# Altium project SZG-STD-FT60X-USBC.PrjPcb
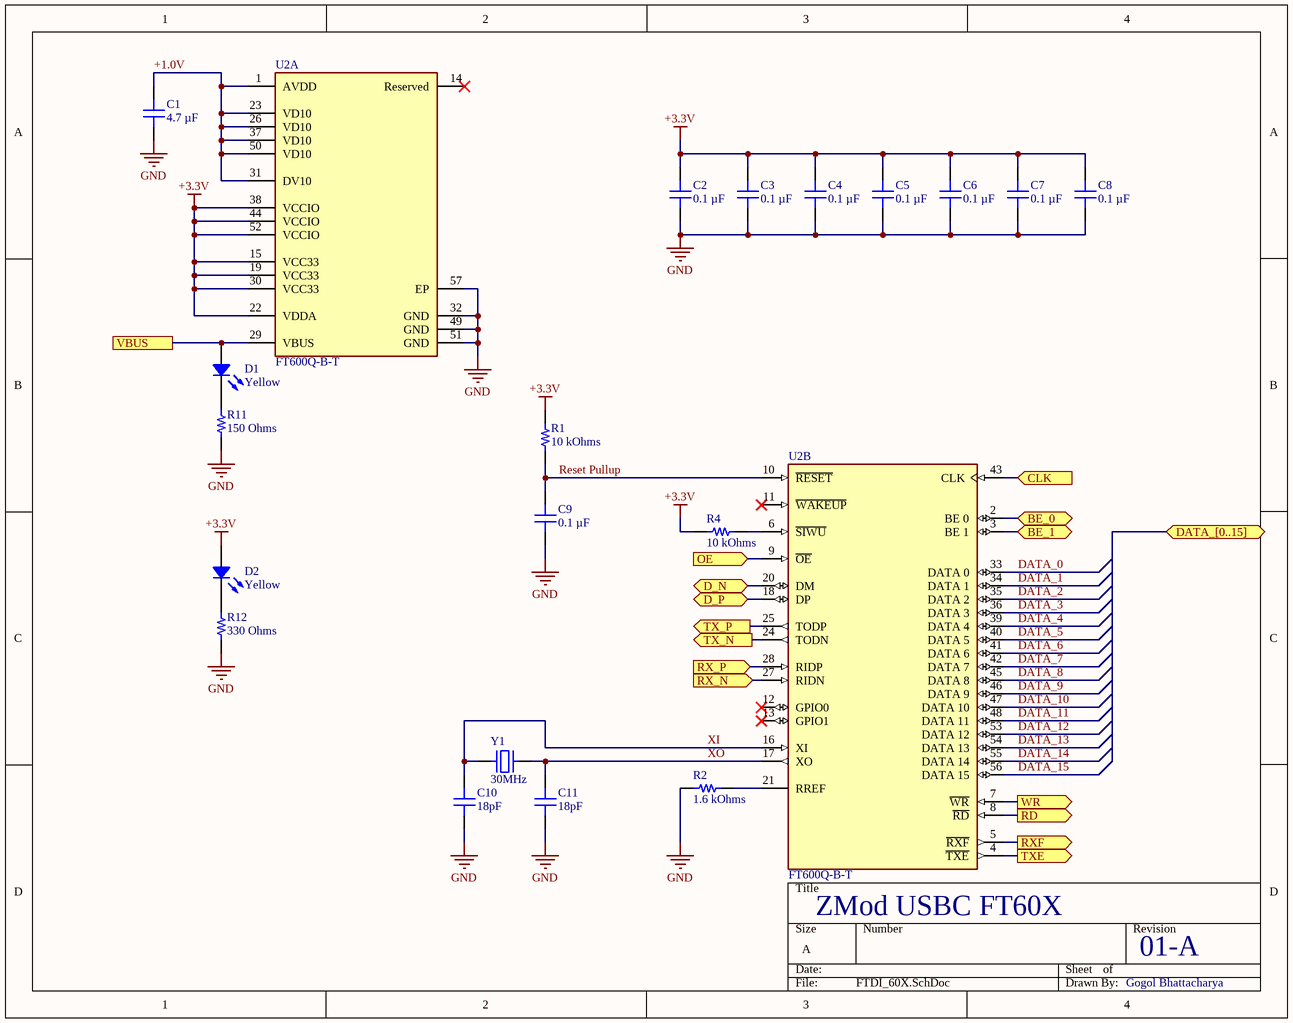
[diagram p0: FTDI_60X.SchDoc]
Engineer: Gogol Bhattacharya; Revision: 01-A; Title: ZMod USBC FT60X
3 sheets, 64 parts. Net scope: global (net labels, ports and power ports of the same name join across sheets).
Board file: SZG-TEMPLATE-STD.PcbDoc
Sheets:
  FTDI_60X.SchDoc
  SZG-TEMPLATE-STD.SchDoc
  USBC.SchDoc

## Sheet FTDI_60X.SchDoc: ZMod USBC FT60X
size A; SheetNumber: 1; SheetTotal: 3

### Parts
C1  value 4.7 µF  [CAPC1005X06N]  (hidden comment: C0402C104K8PACTU)
C2  value 0.1 µF  [CAPC1005X06N]  (hidden comment: C0402C104K8PACTU)
C3  0.1 µF  [CAP 0603_1608]
C4  0.1 µF  [CAP 0603_1608]
C5  0.1 µF  [CAP 0603_1608]
C6  0.1 µF  [CAP 0603_1608]
C7  0.1 µF  [CAP 0603_1608]
C8  0.1 µF  [CAP 0603_1608]
C9  0.1 µF  [CAP 0603_1608]
C10  18pF  [CAP 0603_1608]
C11  18pF  [CAP 0603_1608]
D1  Yellow  [LED 1206_3216 YELLOW]
D2  Yellow  [LED 1206_3216 YELLOW]
R1  value 10 kOhms  [RESC1005X06N]  (hidden comment: CRCW040210K0FKED)
R2  value 1.6 kOhms  [RESC1005X06N]  (hidden comment: CRCW040210K0FKED)
R4  value 10 kOhms  [RESC1005X06N]  (hidden comment: CRCW040210K0FKED)
R11  150 Ohms  [RES 0603_1608]
R12  330 Ohms  [RES 0603_1608]
U2  FT600Q-B-T  [FP-QFN-56-MFG]  (parts A,B of 2)
Y1  30MHz  [ABRACON ABLS]

### Ports
BE_0 (bidir), BE_1 (bidir), CLK (in), D_N (bidir), D_P (bidir), DATA_[0..15] (bidir), OE (in), RD (out), RX_N (in), RX_P (in), RXF (out), TX_N (out), TX_P (out), TXE (out), VBUS, WR (out)

### Nets
+3.3V: C2.2 C3.2 C4.2 C5.2 C6.2 C7.2 C8.2 D2.1 R1.2 R4.2 U2.15(VCC33) U2.19(VCC33) U2.22(VDDA) U2.30(VCC33) U2.38(VCCIO) U2.44(VCCIO) U2.52(VCCIO)
GND: C1.1 C2.1 C3.1 C4.1 C5.1 C6.1 C7.1 C8.1 C9.1 C10.1 C11.1 R2.1 R11.1 R12.1 U2.32(GND) U2.49(GND) U2.51(GND) U2.57(EP)
+1.0V: C1.2 U2.1(AVDD) U2.23(VD10) U2.26(VD10) U2.31(DV10) U2.37(VD10) U2.50(VD10)
BE0: U2.2(BE_0) ; port BE_0
BE1: U2.3(BE_1) ; port BE_1
CLK: U2.43(CLK) ; port CLK
DA_N: U2.20(DM) ; port D_N
DA_P: U2.18(DP) ; port D_P
DATA_0: U2.33(DATA_0)
DATA_1: U2.34(DATA_1)
DATA_2: U2.35(DATA_2)
DATA_3: U2.36(DATA_3)
DATA_4: U2.39(DATA_4)
DATA_5: U2.40(DATA_5)
DATA_6: U2.41(DATA_6)
DATA_7: U2.42(DATA_7)
DATA_8: U2.45(DATA_8)
DATA_9: U2.46(DATA_9)
DATA_10: U2.47(DATA_10)
DATA_11: U2.48(DATA_11)
DATA_12: U2.53(DATA_12)
DATA_13: U2.54(DATA_13)
DATA_14: U2.55(DATA_14)
DATA_15: U2.56(DATA_15)
OE: U2.9(~{OE}) ; port OE
RD: U2.8(~{RD}) ; port RD
Reset Pullup: C9.2 R1.1 U2.10(~{RESET})
RX_N: U2.27(RIDN) ; port RX_N
RX_P: U2.28(RIDP) ; port RX_P
RXF: U2.5(~{RXF}) ; port RXF
TX_N: U2.24(TODN) ; port TX_N
TX_P: U2.25(TODP) ; port TX_P
TXE: U2.4(~{TXE}) ; port TXE
VBUS: D1.1 U2.29(VBUS) ; port VBUS
WR: U2.7(~{WR}) ; port WR
XI: C10.2 U2.16(XI) Y1.1
XO: C11.2 U2.17(XO) Y1.2
NetD1_2: D1.2 R11.2
NetD2_2: D2.2 R12.2
NetR2_2: R2.2 U2.21(RREF)
NetR4_1: R4.1 U2.6(~{SIWU})

Not connected (* = marked no-connect by the designer): U2 11(~{WAKEUP})* 12(GPIO0)* 13(GPIO1)* 14(Reserved)*

### Library data of the parts
C1 = CL10A475KA8NQNC: CAP CER 4.7UF 25V X5R 0603; manufacturer: Samsung Electro-Mechanics; Tolerance: ±10%; Part Number: CL10A475KA8NQNC; Applications: General Purpose; Capacitance: 4.7 µF; componentlink1description: Datasheet; componentlink1url: http://www.samsungsem.com/kr/support/product-search/mlcc/CL10A475KA8NQNC.jsp; componentlink2description: DigiKey Link; componentlink2url: https://www.digikey.com/en/products/detail/samsung-electro-mechanics/CL10A475KA8NQNC/3887558; Device Package: 0603 (1608 Metric); lastupdated: 12/20/2023 8:09:25 PM; Lifecycle Status: Active; Minimum Order: 1; Mounting Type: Surface Mount, MLCC; Operating Temperature: -55°C ~ 85°C; Package / Case: 0603 (1608 Metric); packaging: TapeAndReel; partid: 2349; Part Status: Active; price: 0.06; series: CL; Size / Dimension: 0.063" L x 0.031" W (1.60mm x 0.80mm); Supplier 1: DigiKey; Supplier Part Number 1: 1276-1900-1-ND; Temperature Coefficient: X5R; Thickness (Max): 0.035" (0.90mm); Voltage - Rated: 25V
C2-C9 = C0603C104K5RAC7411: CAP CER 0.1UF 50V X7R 0603; manufacturer: KEMET; Tolerance: ±10%; Part Number: C0603C104K5RAC7411; Applications: Bypass, Decoupling; Capacitance: 0.1 µF; componentlink1description: Datasheet; componentlink1url: https://api.kemet.com/component-edge/download/datasheet/C0603C104K5RAC7411.pdf; componentlink2description: DigiKey Link; componentlink2url: https://www.digikey.com/en/products/detail/kemet/C0603C104K5RAC7411/3317013; Device Package: 0603 (1608 Metric); lastupdated: 12/20/2023 8:09:25 PM; Lifecycle Status: Active; Minimum Order: 1; Mounting Type: Surface Mount, MLCC; Operating Temperature: -55°C ~ 125°C; Package / Case: 0603 (1608 Metric); packaging: TapeAndReel; partid: 2233; Part Status: Active; price: 0.01; series: SMD Comm X7R; Size / Dimension: 0.063" L x 0.031" W (1.60mm x 0.80mm); Supplier 1: DigiKey; Supplier Part Number 1: 399-C0603C104K5RAC7411CT-ND; Temperature Coefficient: X7R; Thickness (Max): 0.035" (0.90mm); Voltage - Rated: 50V
  C3-C9: Value: 0.1 µF
C10 C11 = SQCSVA180JAT1A: CAP CER 18PF 250V 0603; manufacturer: AVX Corporation; Temperature Coefficient: A; Tolerance: ±5%; Part Number: SQCSVA180JAT1A; Value: 18pF; Applications: RF, Microwave, High Frequency; Capacitance: 18pF; componentlink1description: Datasheet; componentlink1url: http://datasheets.avx.com/sqcs-sqcf.pdf; componentlink2description: DigiKey Link; componentlink2url: http://digikey.com/product-detail/en/avx-corporation/SQCSVA180JAT1A/478-3505-1-ND/1000464; Device Package: 0603 (1608 Metric); Features: High Q, Low Loss; lastupdated: 9/2/2020 1:03:34 AM; Lifecycle Status: Active; Minimum Order: 1; Mounting Type: Surface Mount, MLCC; Operating Temperature: -55°C ~ 125°C; Package / Case: 0603 (1608 Metric); packaging: TapeAndReel; partid: 2987; Part Status: Active; price: 0.22; series: SQ; Size / Dimension: 0.063" L x 0.032" W (1.60mm x 0.81mm); Supplier 1: DigiKey; Supplier Part Number 1: 478-3505-1-ND; Thickness (Max): 0.030" (0.76mm); Voltage - Rated: 250V
D1 D2 = CMD11-21VYC/TR8: LED YELLOW CLEAR 1206 SMD; Manufacturer: Visual Communications Company - VCC; Configuration: Standard; Current - Test: 20mA; Lens Color: 1.50mm; Lens Size: 1.10mm Dia; Lens Style: Round with Flat Top; Millicandela Rating: 6mcd; Viewing Angle: 20°; Voltage - Forward (Vf) (Typ): 2V; Wavelength - Peak: 585nm; Part Number: CMD11-21VYC/TR8; Color: Yellow; ComponentLink1Description: Datasheet; ComponentLink1URL: https://vcclite.com/wp-content/uploads/wpallimport/files/files/CMD11-21%20SMT%20LEDs%201206%20Package%20Size.pdf; ComponentLink2Description: DigiKey Link; ComponentLink2URL: https://www.digikey.com/en/products/detail/visual-communications-company-vcc/CMD11-21VYC-TR8/254830; Device Package: 1206 (3216 Metric); Height (Max): 1.50mm; LastUpdated: 12/21/2023 9:31:44 PM; Lens Transparency: Clear; Lifecycle Status: Active; Minimum Order: 1; Mounting Type: Surface Mount; Package / Case: 1206 (3216 Metric); Packaging: TapeAndReel; PartId: 6; Part Status: Active; Price: 0.22; Series: -; Size / Dimension: 3.00mm L x 1.50mm W; Supplier 1: DigiKey; Supplier Part Number 1: 28-CMD11-21VYC/TR8CT-ND; Supplier Device Package: 1206; Value: Yellow
R1 R4 = RT0603FRE0710KL: RES SMD 10K OHM 1% 1/10W 0603; Manufacturer: Yageo; Power (Watts): 0.1W, 1/10W; Temperature Coefficient: ±50ppm/°C; Part Number: RT0603FRE0710KL; ComponentLink1Description: Datasheet; ComponentLink1URL: https://www.yageo.com/upload/media/product/productsearch/datasheet/rchip/PYu-RT_1-to-0.01_RoHS_L_11.pdf; ComponentLink2Description: DigiKey Link; ComponentLink2URL: https://www.digikey.com/en/products/detail/yageo/RT0603FRE0710KL/1075040; Composition: Thin Film; Device Package: 0603 (1608 Metric); Height - Seated (Max): 0.022" (0.55mm); LastUpdated: 12/20/2023 8:39:02 PM; Lifecycle Status: Active; Minimum Order: 1; Number of Terminations: 2; Operating Temperature: -55°C ~ 155°C; Package / Case: 0603 (1608 Metric); Packaging: TapeAndReel; PartId: 5671; Part Status: Active; Price: 0.01; Resistance: 10 kOhms; Series: RT; Size / Dimension: 0.063" L x 0.031" W (1.60mm x 0.80mm); Supplier 1: DigiKey; Supplier Part Number 1: YAG2321CT-ND; Supplier Device Package: 0603; Tolerance: ±1%
R2 = CR0603-FX-1601ELF: RES SMD 1.6K OHM 1% 1/10W 0603; Manufacturer: Bourns Inc.; Power (Watts): 0.1W, 1/10W; Temperature Coefficient: ±100ppm/°C; Part Number: CR0603-FX-1601ELF; ComponentLink1Description: Datasheet; ComponentLink1URL: https://www.bourns.com/docs/Product-Datasheets/CHPREZTR.pdf; ComponentLink2Description: DigiKey Link; ComponentLink2URL: https://www.digikey.com/en/products/detail/bourns-inc/CR0603-FX-1601ELF/3783762; Composition: Thick Film; Device Package: 0603 (1608 Metric); Features: Moisture Resistant; Height - Seated (Max): 0.022" (0.55mm); LastUpdated: 12/20/2023 8:39:01 PM; Lifecycle Status: Active; Minimum Order: 1; Number of Terminations: 2; Operating Temperature: -55°C ~ 155°C; Package / Case: 0603 (1608 Metric); Packaging: CutTape; PartId: 6417; Part Status: Active; Price: 0.01; Resistance: 1.6 kOhms; Series: CR0603; Size / Dimension: 0.063" L x 0.031" W (1.60mm x 0.80mm); Supplier 1: DigiKey; Supplier Part Number 1: CR0603-FX-1601ELFCT-ND; Supplier Device Package: 0603; Tolerance: ±1%
R11 = MCT0603MD1500BP100: RES SMD 150 OHM 0.1% 1/8W 0603; Manufacturer: Vishay Beyschlag; Power (Watts): 0.125W, 1/8W; Temperature Coefficient: ±25ppm/°C; Part Number: MCT0603MD1500BP100; Value: 150 Ohms; ComponentLink1Description: Datasheet; ComponentLink1URL: http://www.vishay.com/docs/28785/mcat_pre.pdf; ComponentLink2Description: DigiKey Link; ComponentLink2URL: http://digikey.com/product-detail/en/vishay-beyschlag/MCT0603MD1500BP100/MCT0603-150-MBCT-ND/2092134; Composition: Thin Film; Device Package: 0603 (1608 Metric); Features: Anti-Sulfur, Automotive AEC-Q200; Height - Seated (Max): 0.022" (0.55mm); LastUpdated: 12/21/2023 8:41:04 PM; Lifecycle Status: Active; Minimum Order: 1; Number of Terminations: 2; Operating Temperature: -55°C ~ 155°C; Package / Case: 0603 (1608 Metric); Packaging: TapeAndReel; PartId: 5246; Part Status: Active; Price: 0.23; Ratings: AEC-Q200; Resistance: 150 Ohms; Series: MCT AT - Precision; Size / Dimension: 0.061" L x 0.033" W (1.55mm x 0.85mm); Supplier 1: DigiKey; Supplier Part Number 1: MCT0603-150-MBCT-ND; Supplier Device Package: 0603; Tolerance: ±0.1%
R12 = CMP0603AFX-3300ELF: RESHIGHPOWERA 0603 330R 1% 1/4W; Manufacturer: Bourns Inc.; Power (Watts): 0.25W, 1/4W; Temperature Coefficient: ±100ppm/°C; Part Number: CMP0603AFX-3300ELF; Value: 330 Ohms; ComponentLink1Description: Datasheet; ComponentLink1URL: https://www.bourns.com/docs/Product-Datasheets/CMP-A.pdf; ComponentLink2Description: DigiKey Link; ComponentLink2URL: https://www.digikey.com/en/products/detail/bourns-inc/CMP0603AFX-3300ELF/12333647; Composition: Thick Film; Device Package: 0603 (1608 Metric); Features: Anti-Sulfur, Automotive AEC-Q200, Moisture Resistant, Pulse Withstanding; Height - Seated (Max): 0.022" (0.55mm); LastUpdated: 12/26/2023 8:37:22 PM; Lifecycle Status: Active; Minimum Order: 1; Number of Terminations: 2; Operating Temperature: -55°C ~ 155°C; Package / Case: 0603 (1608 Metric); Packaging: TapeAndReel; PartId: 62133; Part Status: Active; Price: 0.02; Ratings: AEC-Q200; Resistance: 330 Ohms; Series: CMP-A; Size / Dimension: 0.063" L x 0.031" W (1.60mm x 0.80mm); Supplier 1: DigiKey; Supplier Part Number 1: 118-CMP0603AFX-3300ELFCT-ND; Supplier Device Package: 0603; Tolerance: ±1%
U2 = CMP-004-000002-2: USB Bus Controller, CMOS
Y1 = ABLS-30.000MHZ-B4-F-T: CRYSTAL 30.0000MHZ 18PF SMD; Manufacturer: Abracon LLC; ESR (Equivalent Series Resistance): 40 Ohms; Frequency Stability: ±50ppm; Frequency Tolerance: ±30ppm; Operating Mode: Fundamental; Part Number: ABLS-30.000MHZ-B4-F-T; ComponentLink1Description: Datasheet; ComponentLink1URL: https://abracon.com/Resonators/abls.pdf; ComponentLink2Description: DigiKey Link; ComponentLink2URL: http://digikey.com/product-detail/en/abracon-llc/ABLS-30.000MHZ-B4-F-T/535-10238-2-ND/2184181; Frequency: 30MHz; Height - Seated (Max): 0.165" (4.20mm); LastUpdated: 12/20/2023 9:30:41 PM; Lifecycle Status: Active; Load Capacitance: 18pF; Minimum Order: 0; Mounting Type: Surface Mount; Operating Temperature: -20°C ~ 70°C; Package / Case: HC-49/US; Packaging: TapeAndReel; PartId: 160; Part Status: Active; Price: 0.18; Series: ABLS; Size / Dimension: 0.449" L x 0.185" W (11.40mm x 4.70mm); Supplier 1: DigiKey; Supplier Part Number 1: 535-10238-2-ND; Type: MHz Crystal; Value: 30MHz

## Sheet SZG-TEMPLATE-STD.SchDoc: SZG-TEMPLATE-STD
size B; Organization: Opal Kelly; Address1: 13500 SW 72nd Ave STE 100; Address2: Portland, OR  97223; Address3: 217.391.3724; Address4: http://www.opalkelly.com; DocumentNumber: xxx; Revision: 1; SheetNumber: 2; SheetTotal: 3; PageSetup: Record=PageOptions|CenterHorizontal=True|CenterVertical=True|PrintScale=0.52|XCorrection=1.00|YCorrection=1.00|PrintKind=0|BorderSize=5000000|LeftOffset=0|BottomOffset=0|Orientation=2|PaperLength=1000|PaperWidth=1000|Scale=100|PaperSource=7|PrintQuality=-4|MediaType=1|DitherType=10|PaperKind=Letter|PrintScaleMode=1
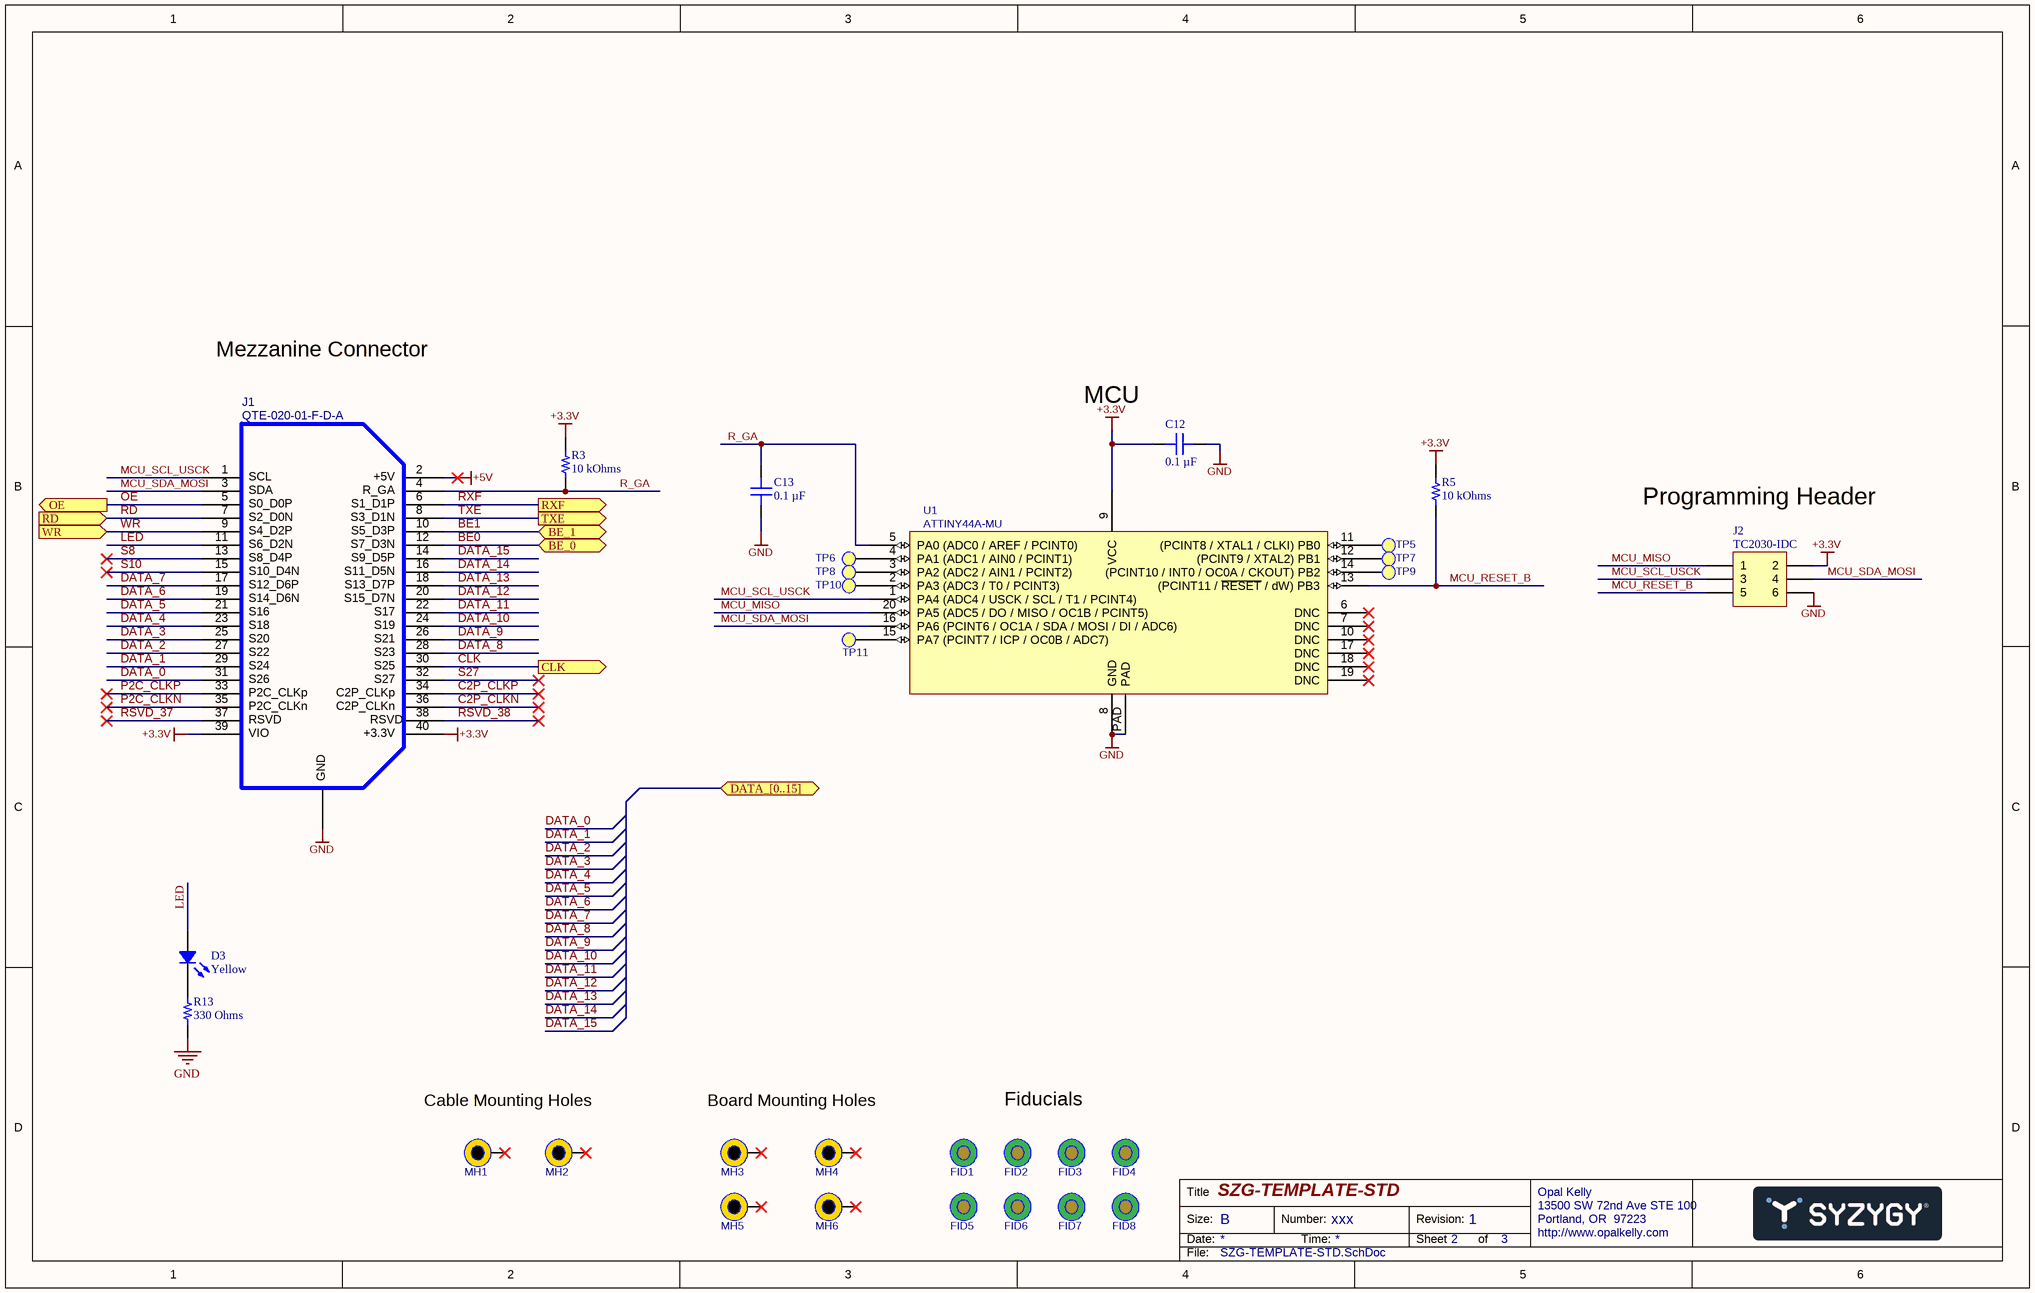
[diagram p1: SZG-TEMPLATE-STD.SchDoc]

### Parts
C12  0.1 µF  [CAP 0201_0603]
C13  0.1 µF  [CAP 0201_0603]
D3  Yellow  [LED 1206_3216 YELLOW]
FID1  FIDUCIAL  [FID1MM/2MM-SS]  (value not drawn)
FID2  FIDUCIAL  [FID1MM/2MM-SS]  (value not drawn)
FID3  FIDUCIAL  [FID1MM/2MM-SS]  (value not drawn)
FID4  FIDUCIAL  [FID1MM/2MM-SS]  (value not drawn)
FID5  FIDUCIAL  [FID1MM/2MM-SS]  (value not drawn)
FID6  FIDUCIAL  [FID1MM/2MM-SS]  (value not drawn)
FID7  FIDUCIAL  [FID1MM/2MM-SS]  (value not drawn)
FID8  FIDUCIAL  [FID1MM/2MM-SS]  (value not drawn)
J1  QTE-020-01-F-D-A  [QTE-020-01-X-D-A-L]
J2  Manufacturer_PN: TC2030-IDC  [TC2030-DUAL]
MH1  MTG  [MTG-3.2/6.5-PTH]  (value not drawn)
MH2  MTG  [MTG-3.2/6.5-PTH]  (value not drawn)
MH3  MTG  [MTG-3.2/6.5-PTH]  (value not drawn)
MH4  MTG  [MTG-3.2/6.5-PTH]  (value not drawn)
MH5  MTG  [MTG-3.2/6.5-PTH]  (value not drawn)
MH6  MTG  [MTG-3.2/6.5-PTH]  (value not drawn)
R3  10 kOhms  [RES 0201_0603]
R5  10 kOhms  [RES 0201_0603]
R13  330 Ohms  [RES 0603_1608]
TP5  TESTPOINT-SMD20  [TP-SMD20]  (value not drawn)
TP6  TESTPOINT-SMD20  [TP-SMD20]  (value not drawn)
TP7  TESTPOINT-SMD20  [TP-SMD20]  (value not drawn)
TP8  TESTPOINT-SMD20  [TP-SMD20]  (value not drawn)
TP9  TESTPOINT-SMD20  [TP-SMD20]  (value not drawn)
TP10  TESTPOINT-SMD20  [TP-SMD20]  (value not drawn)
TP11  TESTPOINT-SMD20  [TP-SMD20]  (value not drawn)
U1  ATTINY44A-MU  [QFN-EP-20]

### Ports
BE_0 (bidir), BE_1 (bidir), CLK (out), DATA_[0..15] (bidir), OE (out), RD (in), RXF (out), TXE (out), WR (in)

### Nets
+3.3V: C12.1 J1.39 J1.40 J2.2 R3.2 R5.2 U1.9(VCC)
+5V: J1.2
GND: C12.2 C13.1 J1.0 J2.6 R13.1 U1.8(GND) U1.PAD
BE0: J1.12 ; port BE_0
BE1: J1.10 ; port BE_1
C2P_CLKN: J1.36
C2P_CLKP: J1.34
CLK: J1.30 ; port CLK
DATA_0: J1.31
DATA_1: J1.29
DATA_2: J1.27
DATA_3: J1.25
DATA_4: J1.23
DATA_5: J1.21
DATA_6: J1.19
DATA_7: J1.17
DATA_8: J1.28
DATA_9: J1.26
DATA_10: J1.24
DATA_11: J1.22
DATA_12: J1.20
DATA_13: J1.18
DATA_14: J1.16
DATA_15: J1.14
LED: D3.1 J1.11
MCU_MISO: J2.1 U1.20(PA5_(ADC5_/_DO_/_MISO_/_OC1B_/_PCINT5))
MCU_RESET_B: J2.5 R5.1 U1.13((PCINT11_/_~{RESET}_/_dW)_PB3)
MCU_SCL_USCK: J1.1 J2.3 U1.1(PA4_(ADC4_/_USCK_/_SCL_/_T1_/_PCINT4))
MCU_SDA_MOSI: J1.3 J2.4 U1.16(PA6_(PCINT6_/_OC1A_/_SDA_/_MOSI_/_DI_/_ADC6))
OE: J1.5 ; port OE
P2C_CLKN: J1.35
P2C_CLKP: J1.33
R_GA: C13.2 J1.4 R3.1 U1.5(PA0_(ADC0_/_AREF_/_PCINT0))
RD: J1.7 ; port RD
RSVD_37: J1.37
RSVD_38: J1.38
RXF: J1.6 ; port RXF
S8: J1.13
S10: J1.15
S27: J1.32
TXE: J1.8 ; port TXE
WR: J1.9 ; port WR
NetD3_2: D3.2 R13.2
NetTP5_1: TP5.1(PIN) U1.11((PCINT8_/_XTAL1_/_CLKI)_PB0)
NetTP6_1: TP6.1(PIN) U1.4(PA1_(ADC1_/_AIN0_/_PCINT1))
NetTP7_1: TP7.1(PIN) U1.12((PCINT9_/_XTAL2)_PB1)
NetTP8_1: TP8.1(PIN) U1.3(PA2_(ADC2_/_AIN1_/_PCINT2))
NetTP9_1: TP9.1(PIN) U1.14((PCINT10_/_INT0_/_OC0A_/_CKOUT)_PB2)
NetTP10_1: TP10.1(PIN) U1.2(PA3_(ADC3_/_T0_/_PCINT3))
NetTP11_1: TP11.1(PIN) U1.15(PA7_(PCINT7_/_ICP_/_OC0B_/_ADC7))

Not connected (* = marked no-connect by the designer): MH1 1*; MH2 1*; MH3 1*; MH4 1*; MH5 1*; MH6 1*; U1 6(DNC)* 7(DNC)* 10(DNC)* 17(DNC)* 18(DNC)* 19(DNC)*

### Notes on the sheet
- Mezzanine Connector
- (near C12) MCU
- Programming Header
- Cable Mounting Holes
- Board Mounting Holes
- Fiducials
- Title
- Size:
- Date:
- B
- Number:
- Time:
- Revision:
- Sheet
- of
- File:
- (in symbol 000973) SCL; +5V; SDA; R_GA; S0_D0P; S1_D1P; S2_D0N; S3_D1N; S4_D2P; S5_D3P; S6_D2N; S7_D3N; S8_D4P; S9_D5P; S10_D4N; S11_D5N; S12_D6P; S13_D7P; S14_D6N; S15_D7N; S16; S17; S18; S19; S20; S21; S22; S23; S24; S25; S26; S27; P2C_CLKp; C2P_CLKp; P2C_CLKn; C2P_CLKn; RSVD; VIO; +3.3V; GND

### Library data of the parts
C12 C13 = EMK063BJ104KP-F: CAP CER 0.1UF 16V X5R 0201; manufacturer: Taiyo Yuden; Tolerance: ±10%; Part Number: EMK063BJ104KP-F; Value: 0.1 µF; Applications: SMPS Filtering; Capacitance: 0.1 µF; componentlink1description: Datasheet; componentlink1url: https://ds.yuden.co.jp/TYCOMPAS/ut/detail?pn=EMK063BJ104KP-F  &u=M; componentlink2description: DigiKey Link; componentlink2url: https://www.digikey.com/en/products/detail/taiyo-yuden/EMK063BJ104KP-F/4970625; Device Package: 0201 (0603 Metric); lastupdated: 12/20/2023 8:01:02 PM; Lifecycle Status: Active; Minimum Order: 1; Mounting Type: Surface Mount, MLCC; Operating Temperature: -55°C ~ 85°C; Package / Case: 0201 (0603 Metric); packaging: TapeAndReel; partid: 12; Part Status: Active; price: 0.01; series: M; Size / Dimension: 0.024" L x 0.012" W (0.60mm x 0.30mm); Supplier 1: DigiKey; Supplier Part Number 1: 587-5833-1-ND; Temperature Coefficient: X5R; Thickness (Max): 0.013" (0.33mm); Voltage - Rated: 16V
D3 = CMD11-21VYC/TR8: as D1 on sheet FTDI_60X; Part Number: CMD11-21VYC/TR8; Color: Yellow; ComponentLink1Description: Datasheet; ComponentLink1URL: https://vcclite.com/wp-content/uploads/wpallimport/files/files/CMD11-21%20SMT%20LEDs%201206%20Package%20Size.pdf; ComponentLink2Description: DigiKey Link; ComponentLink2URL: https://www.digikey.com/en/products/detail/visual-communications-company-vcc/CMD11-21VYC-TR8/254830; Device Package: 1206 (3216 Metric); Height (Max): 1.50mm; LastUpdated: 12/21/2023 9:31:44 PM; Lens Transparency: Clear; Lifecycle Status: Active; Minimum Order: 1; Mounting Type: Surface Mount; Package / Case: 1206 (3216 Metric); Packaging: TapeAndReel; PartId: 6; Part Status: Active; Price: 0.22; Series: -; Size / Dimension: 3.00mm L x 1.50mm W; Supplier 1: DigiKey; Supplier Part Number 1: 28-CMD11-21VYC/TR8CT-ND; Supplier Device Package: 1206; Value: Yellow
FID1-FID8 = FIDUCIAL: PCB fiducial
J1 = 000973: Partnumber: 000973; manufacturer: Samtec; id: 24153; inventory_price: 3.86; created_on: 4/3/2013 1:34:16 PM; manufacturer_pn: QTE-020-01-F-D-A; parttype: Connector; rohs: 1; updated_on: 2/26/2018 2:13:14 PM
J2 = 002062: Tag-Connect 6-pin Plug-of-Nails spring-pin cable footprint; AligniPartNumber: 002062; Manufacturer: Tag-Connect; parttype: Connector
MH1-MH6 = MTG: Mounting hole
R3 R5 = CRCW020110K0FKED: RES SMD 10K OHM 1% 1/20W 0201; Manufacturer: Vishay Dale; Power (Watts): 0.05W, 1/20W; Temperature Coefficient: ±100ppm/°C; Part Number: CRCW020110K0FKED; Value: 10 kOhms; ComponentLink1Description: Datasheet; ComponentLink1URL: http://www.vishay.com/docs/20052/crcw0201e3.pdf; ComponentLink2Description: DigiKey Link; ComponentLink2URL: https://www.digikey.com/en/products/detail/vishay-dale/CRCW020110K0FKED/1967989; Composition: Thick Film; Device Package: 0201 (0603 Metric); Height - Seated (Max): 0.010" (0.26mm); LastUpdated: 12/20/2023 8:19:32 PM; Lifecycle Status: Active; Minimum Order: 1; Number of Terminations: 2; Operating Temperature: -55°C ~ 155°C; Package / Case: 0201 (0603 Metric); Packaging: TapeAndReel; PartId: 29; Part Status: Active; Price: 0.02; Resistance: 10 kOhms; Series: CRCW; Size / Dimension: 0.024" L x 0.012" W (0.60mm x 0.30mm); Supplier 1: DigiKey; Supplier Part Number 1: 541-10.0KAABCT-ND; Supplier Device Package: 0201; Tolerance: ±1%
R13 = CMP0603AFX-3300ELF: as R12 on sheet FTDI_60X; Part Number: CMP0603AFX-3300ELF; Value: 330 Ohms; ComponentLink1Description: Datasheet; ComponentLink1URL: https://www.bourns.com/docs/Product-Datasheets/CMP-A.pdf; ComponentLink2Description: DigiKey Link; ComponentLink2URL: https://www.digikey.com/en/products/detail/bourns-inc/CMP0603AFX-3300ELF/12333647; Composition: Thick Film; Device Package: 0603 (1608 Metric); Features: Anti-Sulfur, Automotive AEC-Q200, Moisture Resistant, Pulse Withstanding; Height - Seated (Max): 0.022" (0.55mm); LastUpdated: 12/26/2023 8:37:22 PM; Lifecycle Status: Active; Minimum Order: 1; Number of Terminations: 2; Operating Temperature: -55°C ~ 155°C; Package / Case: 0603 (1608 Metric); Packaging: TapeAndReel; PartId: 62133; Part Status: Active; Price: 0.02; Ratings: AEC-Q200; Resistance: 330 Ohms; Series: CMP-A; Size / Dimension: 0.063" L x 0.031" W (1.60mm x 0.80mm); Supplier 1: DigiKey; Supplier Part Number 1: 118-CMP0603AFX-3300ELFCT-ND; Supplier Device Package: 0603; Tolerance: ±1%
TP5-TP11 = TESTPOINT-SMD20: Test point, surface-mount, 20mil
U1 = 001552: 8-bit MCU, 4 KB flash, 256 bytes EEPROM; Manufacturer: Microchip; partnumber: 001552; x_lifecycle_status: Production; Manufacturer_PN: ATTINY44A-MU; updated_on: 5/23/2017 10:51:21 AM

## Sheet USBC.SchDoc: ZMod USBC FT60X
size A; SheetNumber: 3; SheetTotal: 3
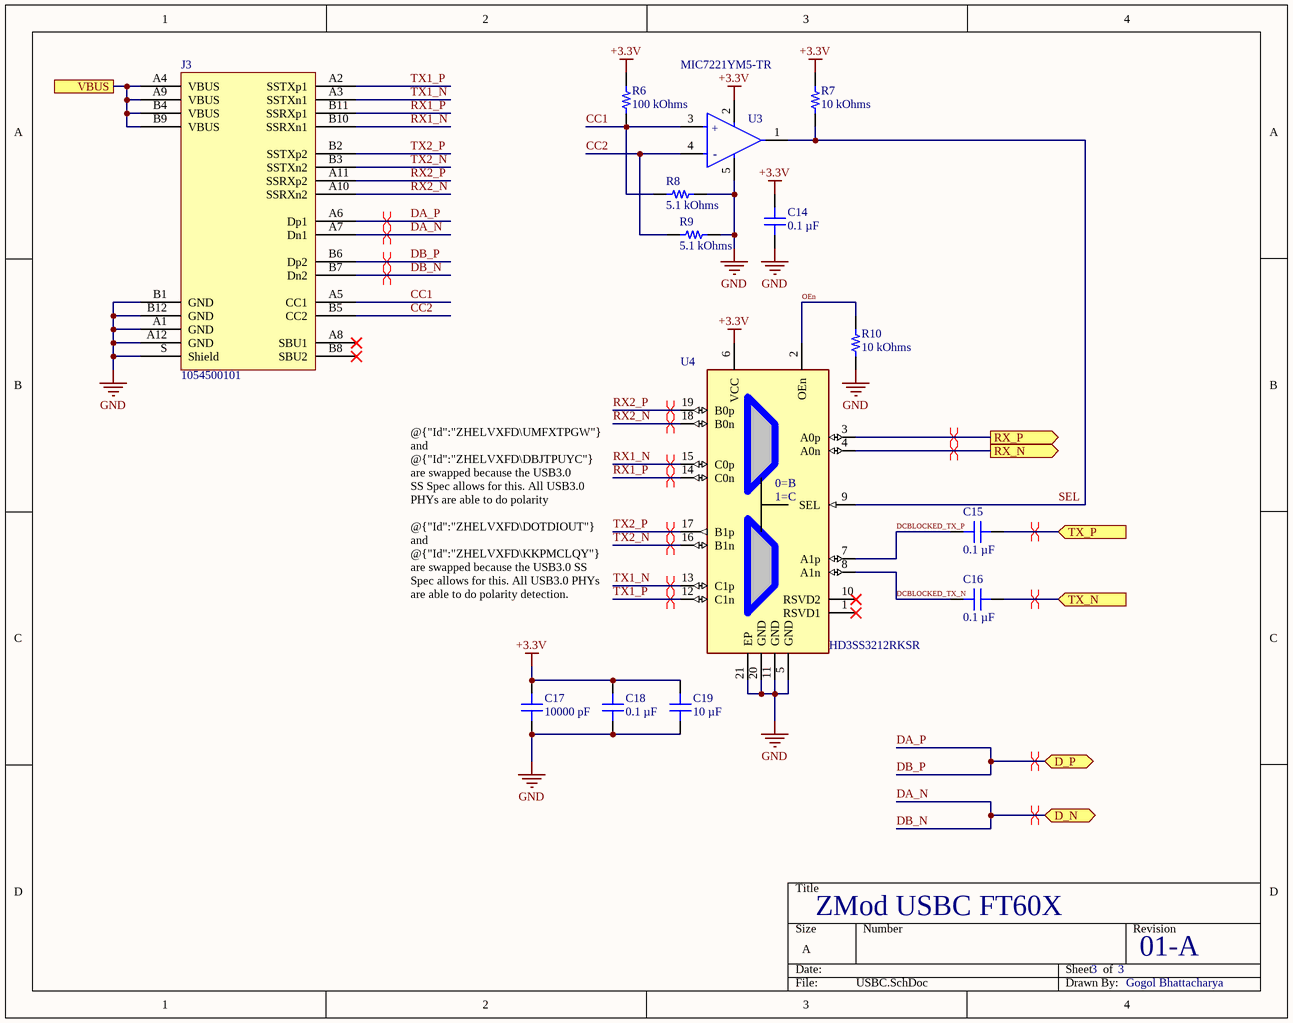
[diagram p2: USBC.SchDoc]

### Parts
C14  0.1 µF  [CAP 0603_1608]
C15  0.1 µF  [CAP 0603_1608]
C16  0.1 µF  [CAP 0603_1608]
C17  10000 pF  [CAP 0603_1608]
C18  0.1 µF  [CAP 0603_1608]
C19  10 µF  [CAP 0603_1608]
J3  1054500101  [Molex 1054500101]
R6  100 kOhms  [RES 0603_1608]
R7  10 kOhms  [RES 0603_1608]
R8  5.1 kOhms  [RES 0603_1608]
R9  5.1 kOhms  [RES 0603_1608]
R10  10 kOhms  [RES 0603_1608]
U3  MIC7221YM5-TR  [FP-SOT23-5LD-PL-1-IPC_B]
U4  HD3SS3212RKSR  [FP-RKS0020A-MFG]

### Ports
D_N (bidir), D_P (bidir), RX_N (out), RX_P (out), TX_N (in), TX_P (in), VBUS

### Nets
+3.3V: C14.2 C17.2 C18.1 C19.2 R6.2 R7.2 U3.2(V+) U4.6(VCC)
GND: C14.1 C17.1 C18.2 C19.1 J3.A1(GND) J3.A12(GND) J3.B1(GND) J3.B12(GND) J3.S(Shield) R8.2 R9.2 R10.1 U3.5(V-) U4.5(GND) U4.11(GND) U4.20(GND) U4.21(EP)
CC1: J3.A5(CC1) R6.1 R8.1 U3.3(IN+)
CC2: J3.B5(CC2) R9.1 U3.4(IN-)
DA_N: J3.A7(Dn1) J3.B7(Dn2) ; port D_N  [also labelled DB_N]
DA_P: J3.A6(Dp1) J3.B6(Dp2) ; port D_P  [also labelled DB_P]
DCBLOCKED_TX_N: C16.1 U4.8(A1n)
DCBLOCKED_TX_P: C15.1 U4.7(A1p)
OEn: R10.2 U4.2(OEn)
RX1_N: J3.B10(SSRXn1) U4.15(C0p)
RX1_P: J3.B11(SSRXp1) U4.14(C0n)
RX2_N: J3.A10(SSRXn2) U4.18(B0n)
RX2_P: J3.A11(SSRXp2) U4.19(B0p)
RX_N: U4.4(A0n) ; port RX_N
RX_P: U4.3(A0p) ; port RX_P
SEL: R7.1 U3.1(OUT) U4.9(SEL)
TX1_N: J3.A3(SSTXn1) U4.13(C1p)
TX1_P: J3.A2(SSTXp1) U4.12(C1n)
TX2_N: J3.B3(SSTXn2) U4.16(B1n)
TX2_P: J3.B2(SSTXp2) U4.17(B1p)
TX_N: C16.2 ; port TX_N
TX_P: C15.2 ; port TX_P
VBUS: J3.A4(VBUS) J3.A9(VBUS) J3.B4(VBUS) J3.B9(VBUS) ; port VBUS

Not connected (* = marked no-connect by the designer): J3 A8(SBU1)* B8(SBU2)*; U4 1(RSVD1)* 10(RSVD2)*

### Layout directives
differential pair: DA_N, DA_P, RX1_N, RX1_P, RX2_N, RX2_P, RX_N, RX_P, TX1_N, TX1_P, TX2_N, TX2_P, TX_N, TX_P

### Notes on the sheet
- @{"Id":"ZHELVXFD\UMFXTPGW"} and @{"Id":"ZHELVXFD\DBJTPUYC"} are swapped because the USB3.0 SS Spec allows for this. All USB3.0 PHYs are able to do polarity detection.
- @{"Id":"ZHELVXFD\DOTDIOUT"} and @{"Id":"ZHELVXFD\KKPMCLQY"} are swapped because the USB3.0 SS Spec allows for this. All USB3.0 PHYs are able to do polarity detection.
- (in symbol CMP-004-000003-1) +; -
- (in symbol CMP-004-000004-3) 0=B; 1=C

### Library data of the parts
C14-C16 C18 = C0603C104K5RAC7411: as C2 on sheet FTDI_60X; Part Number: C0603C104K5RAC7411; Value: 0.1 µF; Applications: Bypass, Decoupling; Capacitance: 0.1 µF; componentlink1description: Datasheet; componentlink1url: https://api.kemet.com/component-edge/download/datasheet/C0603C104K5RAC7411.pdf; componentlink2description: DigiKey Link; componentlink2url: https://www.digikey.com/en/products/detail/kemet/C0603C104K5RAC7411/3317013; Device Package: 0603 (1608 Metric); lastupdated: 12/20/2023 8:09:25 PM; Lifecycle Status: Active; Minimum Order: 1; Mounting Type: Surface Mount, MLCC; Operating Temperature: -55°C ~ 125°C; Package / Case: 0603 (1608 Metric); packaging: TapeAndReel; partid: 2233; Part Status: Active; price: 0.01; series: SMD Comm X7R; Size / Dimension: 0.063" L x 0.031" W (1.60mm x 0.80mm); Supplier 1: DigiKey; Supplier Part Number 1: 399-C0603C104K5RAC7411CT-ND; Temperature Coefficient: X7R; Thickness (Max): 0.035" (0.90mm); Voltage - Rated: 50V
C17 = C0603X103K1RAC3316: CAP CER 0603 10NF 100V X7R; manufacturer: KEMET; Tolerance: ±10%; Part Number: C0603X103K1RAC3316; Value: 10000 pF; Applications: Automotive, Boardflex Sensitive; Capacitance: 10000 pF; componentlink1description: Datasheet; componentlink1url: https://api.kemet.com/component-edge/download/datasheet/C0603X103K1RAC3316.pdf; componentlink2description: DigiKey Link; componentlink2url: https://www.digikey.com/en/products/detail/kemet/C0603X103K1RAC3316/10315782; Device Package: 0603 (1608 Metric); Features: Soft Termination; lastupdated: 12/20/2023 8:09:17 PM; Lifecycle Status: Active; Minimum Order: 1; Mounting Type: Surface Mount, MLCC; Operating Temperature: -55°C ~ 125°C; Package / Case: 0603 (1608 Metric); packaging: TapeAndReel; partid: 8591; Part Status: Active; price: 0.07; Ratings: AEC-Q200; series: SMD Auto X7R VW80808; Size / Dimension: 0.063" L x 0.031" W (1.60mm x 0.80mm); Supplier 1: DigiKey; Supplier Part Number 1: 399-C0603X103K1RAC3316CT-ND; Temperature Coefficient: X7R; Thickness (Max): 0.037" (0.95mm); Voltage - Rated: 100V
C19 = GRT188R61C106ME13D: CAP CER 10UF 16V X5R 0603; manufacturer: Murata Electronics; Tolerance: ±20%; Part Number: GRT188R61C106ME13D; Value: 10 µF; Applications: Automotive; Capacitance: 10 µF; componentlink1description: Datasheet; componentlink1url: https://search.murata.co.jp/Ceramy/image/img/A01X/G101/ENG/GRT188R61C106ME13-01.pdf; componentlink2description: DigiKey Link; componentlink2url: https://www.digikey.com/en/products/detail/murata-electronics/GRT188R61C106ME13D/5416740; Device Package: 0603 (1608 Metric); lastupdated: 12/20/2023 8:09:24 PM; Lifecycle Status: Active; Minimum Order: 1; Mounting Type: Surface Mount, MLCC; Operating Temperature: -55°C ~ 85°C; Package / Case: 0603 (1608 Metric); packaging: TapeAndReel; partid: 2515; Part Status: Active; price: 0.06; Ratings: AEC-Q200; series: GRT; Size / Dimension: 0.063" L x 0.031" W (1.60mm x 0.80mm); Supplier 1: DigiKey; Supplier Part Number 1: 490-12318-1-ND; Temperature Coefficient: X5R; Thickness (Max): 0.035" (0.90mm); Voltage - Rated: 16V
J3 = 1054500101: CONN RCP USB3.1 TYPEC 24P SMD RA; Manufacturer: Molex; Connector Type: USB - C (Type - C); Current Rating (Amps): 0.25A, 1A, 5A; Gender: Receptacle; Mating Cycles: 10000; Number of Contacts: 24; Number of Ports: 1; Shielding: Shielded; Specifications: USB 3.1 (USB 3.1 Gen 2, Superspeed+); Voltage - Rated: 30VAC/DC; Part Number: 1054500101; ComponentLink1Description: Datasheet; ComponentLink1URL: https://www.molex.com/pdm_docs/ps/PS-105448-001.pdf; ComponentLink2Description: DigiKey Link; ComponentLink2URL: http://digikey.com/product-detail/en/molex/1054500101/WM12856CT-ND/5843891; LastUpdated: 6/6/2020 2:14:04 AM; Lifecycle Status: Active; Minimum Order: 1; Mounting Feature: Horizontal; Mounting Type: Surface Mount, Right Angle; Through Hole; Operating Temperature: -30°C ~ 85°C; Packaging: TapeAndReel; Part Status: Active; Price: 1.22; Series: 105445; Supplier 1: DigiKey; Supplier Part Number 1: WM12856CT-ND; Termination: Solder
R6 = RCS0603100KFKEA: RES SMD 100K OHM 1% 1/4W 0603; Manufacturer: Vishay Dale; Power (Watts): 0.25W, 1/4W; Temperature Coefficient: ±100ppm/°C; Part Number: RCS0603100KFKEA; Value: 100 kOhms; ComponentLink1Description: Datasheet; ComponentLink1URL: http://www.vishay.com/docs/20065/rcse3.pdf; ComponentLink2Description: DigiKey Link; ComponentLink2URL: https://www.digikey.com/en/products/detail/vishay-dale/RCS0603100KFKEA/5866946; Composition: Thick Film; Device Package: 0603 (1608 Metric); Features: Automotive AEC-Q200, Pulse Withstanding; Height - Seated (Max): 0.020" (0.50mm); LastUpdated: 12/20/2023 8:39:03 PM; Lifecycle Status: Active; Minimum Order: 1; Number of Terminations: 2; Operating Temperature: -55°C ~ 155°C; Package / Case: 0603 (1608 Metric); Packaging: TapeAndReel; PartId: 5363; Part Status: Active; Price: 0.01; Ratings: AEC-Q200; Resistance: 100 kOhms; Series: RCS e3; Size / Dimension: 0.061" L x 0.033" W (1.55mm x 0.85mm); Supplier 1: DigiKey; Supplier Part Number 1: 541-2800-1-ND; Supplier Device Package: 0603; Tolerance: ±1%
R7 R10 = RT0603FRE0710KL: as R1 on sheet FTDI_60X; Part Number: RT0603FRE0710KL; Value: 10 kOhms; ComponentLink1Description: Datasheet; ComponentLink1URL: https://www.yageo.com/upload/media/product/productsearch/datasheet/rchip/PYu-RT_1-to-0.01_RoHS_L_11.pdf; ComponentLink2Description: DigiKey Link; ComponentLink2URL: https://www.digikey.com/en/products/detail/yageo/RT0603FRE0710KL/1075040; Composition: Thin Film; Device Package: 0603 (1608 Metric); Height - Seated (Max): 0.022" (0.55mm); LastUpdated: 12/20/2023 8:39:02 PM; Lifecycle Status: Active; Minimum Order: 1; Number of Terminations: 2; Operating Temperature: -55°C ~ 155°C; Package / Case: 0603 (1608 Metric); Packaging: TapeAndReel; PartId: 5671; Part Status: Active; Price: 0.01; Resistance: 10 kOhms; Series: RT; Size / Dimension: 0.063" L x 0.031" W (1.60mm x 0.80mm); Supplier 1: DigiKey; Supplier Part Number 1: YAG2321CT-ND; Supplier Device Package: 0603; Tolerance: ±1%
R8 R9 = TNPW06035K10BYEN: RES 5.1K OHM 0.1% 1/10W 0603; Manufacturer: Vishay Dale; Power (Watts): 0.125W, 1/8W; Temperature Coefficient: ±10ppm/°C; Part Number: TNPW06035K10BYEN; Value: 5.1 kOhms; ComponentLink1Description: Datasheet; ComponentLink1URL: http://www.vishay.com/docs/28758/tnpw_e3.pdf; ComponentLink2Description: DigiKey Link; ComponentLink2URL: http://digikey.com/product-detail/en/vishay-dale/TNPW06035K10BYEN/541-9831-1-ND/9562456; Composition: Thin Film; Device Package: 0603 (1608 Metric); Features: Anti-Sulfur, Automotive AEC-Q200, Moisture Resistant; Height - Seated (Max): 0.022" (0.55mm); LastUpdated: 12/20/2023 8:39:04 PM; Lifecycle Status: Active; Minimum Order: 1; Number of Terminations: 2; Operating Temperature: -55°C ~ 155°C; Package / Case: 0603 (1608 Metric); Packaging: TapeAndReel; PartId: 5273; Part Status: Active; Price: 0.27; Ratings: AEC-Q200; Resistance: 5.1 kOhms; Series: TNPW e3; Size / Dimension: 0.061" L x 0.033" W (1.55mm x 0.85mm); Supplier 1: DigiKey; Supplier Part Number 1: 541-9831-1-ND; Supplier Device Package: 0603; Tolerance: ±0.1%
U3 = CMP-004-000003-1: Comparator, 1 Func, 10000uV Offset-Max, 75ns Response Time, CMOS, PDSO5
U4 = CMP-004-000004-3: Differential Multiplexer, 2 Func, 2 Channel, PQCC20

## Nets that join several sheets
+3.3V: FTDI_60X (17 pins), SZG-TEMPLATE-STD (7 pins), USBC (8 pins)
GND: FTDI_60X (18 pins), SZG-TEMPLATE-STD (7 pins), USBC (17 pins)
BE0: FTDI_60X (U2.2), SZG-TEMPLATE-STD (J1.12)
BE1: FTDI_60X (U2.3), SZG-TEMPLATE-STD (J1.10)
CLK: FTDI_60X (U2.43), SZG-TEMPLATE-STD (J1.30)
DA_N: FTDI_60X (U2.20), USBC (J3.A7 J3.B7)
DA_P: FTDI_60X (U2.18), USBC (J3.A6 J3.B6)
DATA_0: FTDI_60X (U2.33), SZG-TEMPLATE-STD (J1.31)
DATA_1: FTDI_60X (U2.34), SZG-TEMPLATE-STD (J1.29)
DATA_2: FTDI_60X (U2.35), SZG-TEMPLATE-STD (J1.27)
DATA_3: FTDI_60X (U2.36), SZG-TEMPLATE-STD (J1.25)
DATA_4: FTDI_60X (U2.39), SZG-TEMPLATE-STD (J1.23)
DATA_5: FTDI_60X (U2.40), SZG-TEMPLATE-STD (J1.21)
DATA_6: FTDI_60X (U2.41), SZG-TEMPLATE-STD (J1.19)
DATA_7: FTDI_60X (U2.42), SZG-TEMPLATE-STD (J1.17)
DATA_8: FTDI_60X (U2.45), SZG-TEMPLATE-STD (J1.28)
DATA_9: FTDI_60X (U2.46), SZG-TEMPLATE-STD (J1.26)
DATA_10: FTDI_60X (U2.47), SZG-TEMPLATE-STD (J1.24)
DATA_11: FTDI_60X (U2.48), SZG-TEMPLATE-STD (J1.22)
DATA_12: FTDI_60X (U2.53), SZG-TEMPLATE-STD (J1.20)
DATA_13: FTDI_60X (U2.54), SZG-TEMPLATE-STD (J1.18)
DATA_14: FTDI_60X (U2.55), SZG-TEMPLATE-STD (J1.16)
DATA_15: FTDI_60X (U2.56), SZG-TEMPLATE-STD (J1.14)
OE: FTDI_60X (U2.9), SZG-TEMPLATE-STD (J1.5)
RD: FTDI_60X (U2.8), SZG-TEMPLATE-STD (J1.7)
RX_N: FTDI_60X (U2.27), USBC (U4.4)
RX_P: FTDI_60X (U2.28), USBC (U4.3)
RXF: FTDI_60X (U2.5), SZG-TEMPLATE-STD (J1.6)
TX_N: FTDI_60X (U2.24), USBC (C16.2)
TX_P: FTDI_60X (U2.25), USBC (C15.2)
TXE: FTDI_60X (U2.4), SZG-TEMPLATE-STD (J1.8)
VBUS: FTDI_60X (D1.1 U2.29), USBC (J3.A4 J3.A9 J3.B4 J3.B9)
WR: FTDI_60X (U2.7), SZG-TEMPLATE-STD (J1.9)

## Assembly variants
Default: not fitted C2 J2 J2 J3